# EAGLE design hdreader (EAGLE 6.5.0)
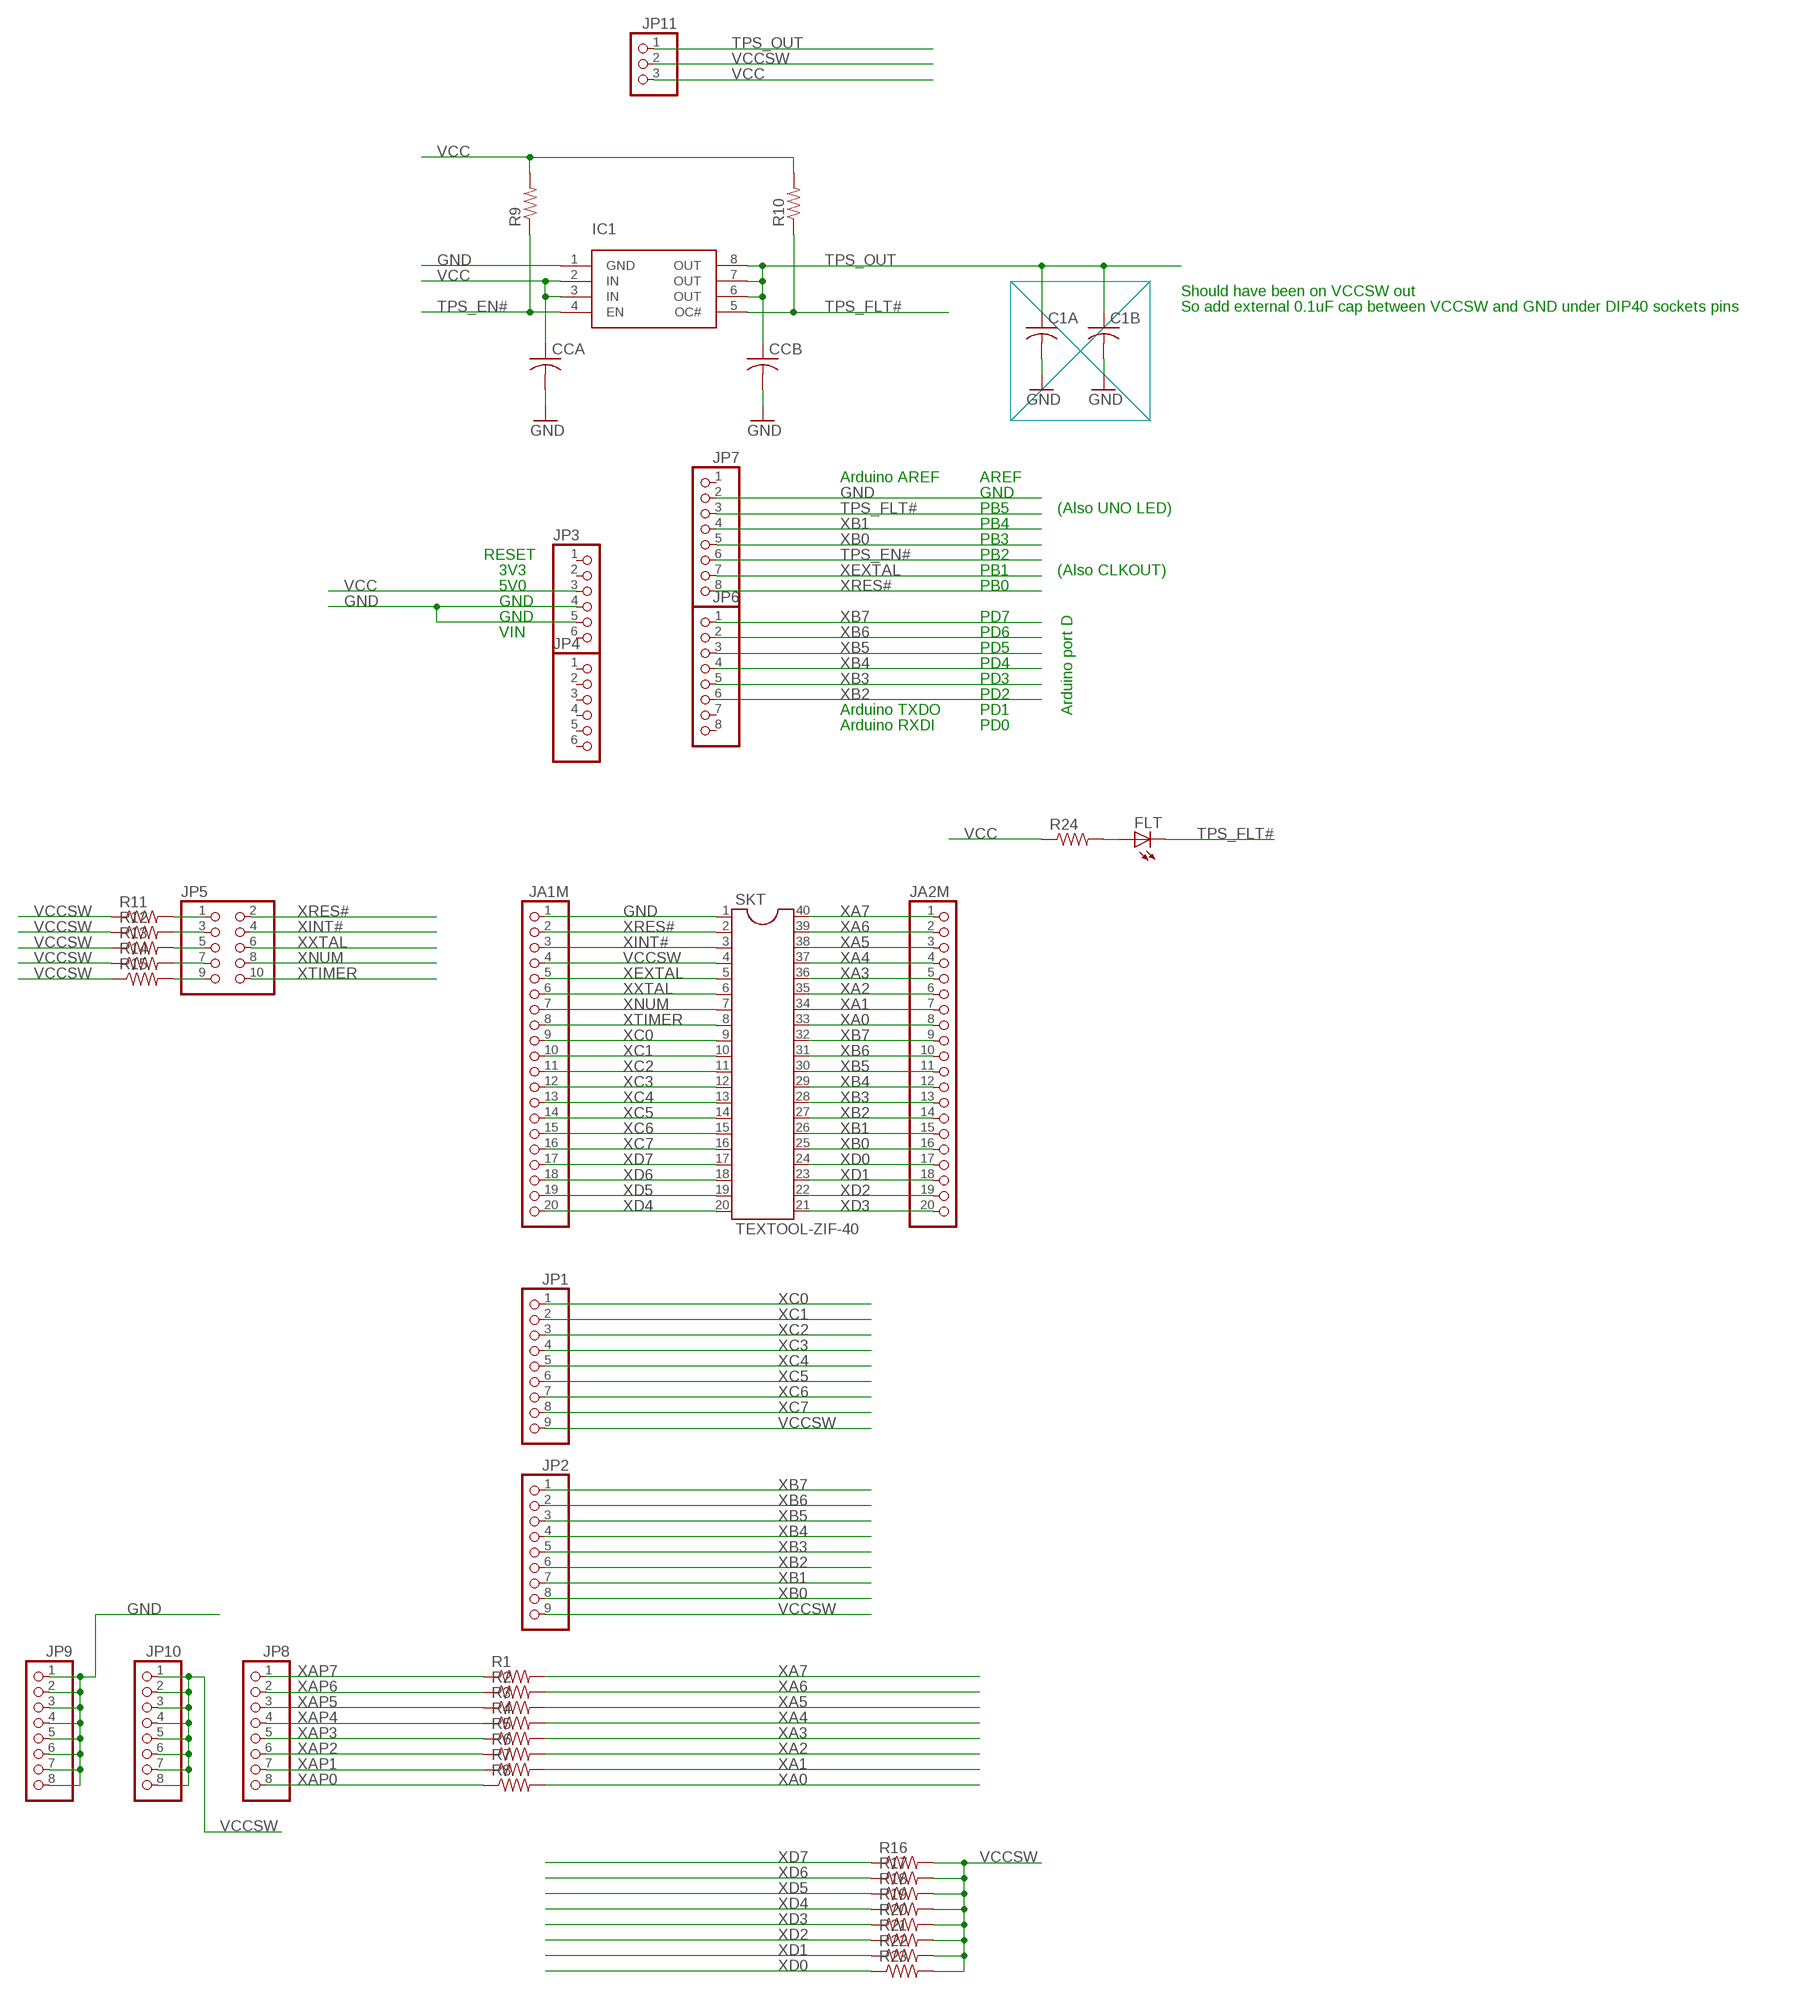
[diagram p0: schematic, sheet 1]

## Parts
C1A  C-USC0603  [C0603]
C1B  C-USC0603  [C0603]
CCA  C-USC0603  [C0603]
CCB  C-USC0603  [C0603]
FLT  LED3MM  [LED3MM]
IC1  TPS2051D  [SOIC8]
JA1M  PINHD-1X20  [1X20]
JA2M  PINHD-1X20  [1X20]
JP1  PINHD-1X9  [1X09]
JP2  PINHD-1X9  [1X09]
JP3  PINHD-1X6  [1X06]
JP4  PINHD-1X6  [1X06]
JP5  PINHD-2X5  [2X05]
JP6  PINHD-1X8  [1X08]
JP7  PINHD-1X8  [1X08]
JP8  PINHD-1X8  [1X08]
JP9  PINHD-1X8  [1X08]
JP10  PINHD-1X8  [1X08]
JP11  PINHD-1X3  [1X03]
R1  R-US_R0603  [R0603]
R2  R-US_R0603  [R0603]
R3  R-US_R0603  [R0603]
R4  R-US_R0603  [R0603]
R5  R-US_R0603  [R0603]
R6  R-US_R0603  [R0603]
R7  R-US_R0603  [R0603]
R8  R-US_R0603  [R0603]
R9  R-US_R0603  [R0603]
R10  R-US_R0603  [R0603]
R11  R-US_R0603  [R0603]
R12  R-US_R0603  [R0603]
R13  R-US_R0603  [R0603]
R14  R-US_R0603  [R0603]
R15  R-US_R0603  [R0603]
R16  R-US_R0603  [R0603]
R17  R-US_R0603  [R0603]
R18  R-US_R0603  [R0603]
R19  R-US_R0603  [R0603]
R20  R-US_R0603  [R0603]
R21  R-US_R0603  [R0603]
R22  R-US_R0603  [R0603]
R23  R-US_R0603  [R0603]
R24  R-US_R0603  [R0603]
SKT  TEXTOOL-ZIF-40  [TEXTOOL-DIP-40]

## Nets
GND: C1A.2 C1B.2 CCA.2 CCB.2 IC1.1(GND) JA1M.1 JP3.4 JP3.5 JP7.2 JP9.1 JP9.2 JP9.3 JP9.4 JP9.5 JP9.6 JP9.7 JP9.8 SKT.1
N$1: FLT.A R24.2
N$3: JP5.1 R11.2
N$4: JP5.3 R12.2
N$5: JP5.5 R13.2
N$14: JP5.7 R14.2
N$15: JP5.9 R15.2
TPS_EN#: IC1.4(EN) JP7.6 R9.1
TPS_FLT#: FLT.K(C) IC1.5(OC#) JP7.3 R10.1
TPS_OUT: C1A.1 C1B.1 CCB.1 IC1.6(OUT) IC1.7(OUT) IC1.8(OUT) JP11.1
VCC: CCA.1 IC1.2(IN) IC1.3(IN) JP3.3 JP11.3 R9.2 R10.2 R24.1
VCCSW: JA1M.4 JP1.9 JP2.9 JP10.1 JP10.2 JP10.3 JP10.4 JP10.5 JP10.6 JP10.7 JP10.8 JP11.2 R11.1 R12.1 R13.1 R14.1 R15.1 R16.2 R17.2 R18.2 R19.2 R20.2 R21.2 R22.2 R23.2 SKT.4
XA0: JA2M.8 R8.2 SKT.33
XA1: JA2M.7 R7.2 SKT.34
XA2: JA2M.6 R6.2 SKT.35
XA3: JA2M.5 R5.2 SKT.36
XA4: JA2M.4 R4.2 SKT.37
XA5: JA2M.3 R3.2 SKT.38
XA6: JA2M.2 R2.2 SKT.39
XA7: JA2M.1 R1.2 SKT.40
XAP0: JP8.8 R8.1
XAP1: JP8.7 R7.1
XAP2: JP8.6 R6.1
XAP3: JP8.5 R5.1
XAP4: JP8.4 R4.1
XAP5: JP8.3 R3.1
XAP6: JP8.2 R2.1
XAP7: JP8.1 R1.1
XB0: JA2M.16 JP2.8 JP7.5 SKT.25
XB1: JA2M.15 JP2.7 JP7.4 SKT.26
XB2: JA2M.14 JP2.6 JP6.6 SKT.27
XB3: JA2M.13 JP2.5 JP6.5 SKT.28
XB4: JA2M.12 JP2.4 JP6.4 SKT.29
XB5: JA2M.11 JP2.3 JP6.3 SKT.30
XB6: JA2M.10 JP2.2 JP6.2 SKT.31
XB7: JA2M.9 JP2.1 JP6.1 SKT.32
XC0: JA1M.9 JP1.1 SKT.9
XC1: JA1M.10 JP1.2 SKT.10
XC2: JA1M.11 JP1.3 SKT.11
XC3: JA1M.12 JP1.4 SKT.12
XC4: JA1M.13 JP1.5 SKT.13
XC5: JA1M.14 JP1.6 SKT.14
XC6: JA1M.15 JP1.7 SKT.15
XC7: JA1M.16 JP1.8 SKT.16
XD0: JA2M.17 R23.1 SKT.24
XD1: JA2M.18 R22.1 SKT.23
XD2: JA2M.19 R21.1 SKT.22
XD3: JA2M.20 R20.1 SKT.21
XD4: JA1M.20 R19.1 SKT.20
XD5: JA1M.19 R18.1 SKT.19
XD6: JA1M.18 R17.1 SKT.18
XD7: JA1M.17 R16.1 SKT.17
XEXTAL: JA1M.5 JP7.7 SKT.5
XINT#: JA1M.3 JP5.4 SKT.3
XNUM: JA1M.7 JP5.8 SKT.7
XRES#: JA1M.2 JP5.2 JP7.8 SKT.2
XTIMER: JA1M.8 JP5.10 SKT.8
XXTAL: JA1M.6 JP5.6 SKT.6
Unconnected: JP3.1 JP3.2 JP3.6 JP4.1 JP4.2 JP4.3 JP4.4 JP4.5 JP4.6 JP6.7 JP6.8 JP7.1

## Notes on the sheet
- Should have been on VCCSW out
- So add external 0.1uF cap between VCCSW and GND under DIP40 sockets pins
- Arduino AREF | AREF
- GND
- PB5 | (Also UNO LED)
- PB4
- PB3
- RESET | PB2
- 3V3 | PB1 | (Also CLKOUT)
- 5V0 | PB0
- GND
- GND | PD7
- VIN | PD6
- PD5
- PD4
- PD3
- PD2
- Arduino TXDO | PD1 | Arduino port D
- Arduino RXDI | PD0

## Library data of the parts
C1A C1B CCA CCB = rcl:C-US: CAPACITOR, American symbol
FLT = led:LED: LED OSRAM: - CHIPLED LG R971, LG N971, LY N971, LG Q971, LY Q971, LO R971, LY R971 LH N974, LH R974 LS Q976, LO Q976, LY Q976 LO Q996 - Hyper CHIPLED LW Q18S LB Q993, LB Q99A, LB R99A - SideLED LS A670, LO A670, LY A670, LG A670, LP A670 LB A673, LV A673, LT A673, LW A673 LH A674 LY A675 LS A676, LA A676, LO A676, LY A676, LW A676 LS A679, LY A679, LG A679 - Hyper Micro SIDELED® LS Y876, LA Y876, LO Y876, LY Y876 LT Y87S - SmartLED LW L88C, LW L88S LB L89C, LB L89S, LG L890 LS L89K, LO L89K, LY L89K LS L896, LA L896, LO L896, LY L896 - TOPLED LS T670, LO T670, LY T670, LG T670, LP T670 LSG T670, LSP T670, LSY T670, LOP T670, LYG T670 LG T671, LOG T671, LSG T671 LB T673, LV T673, LT T673, LW T673 LH T674 LS T676, LA T676, LO T676, LY T676, LB T676, LH T676, LSB T676, LW T676 LB T67C, LV T67C, LT T67C, LS T67K, LO T67K, LY T67K, LW E67C LS E67B, LA E67B, LO E67B, LY E67B, LB E67C, LV E67C, LT E67C LW T67C LS T679, LY T679, LG T679 LS T770, LO T770, LY T770, LG T770, LP T770 LB T773, LV T773, LT T773, LW T773 LH T774 LS E675, LA E675, LY E675, LS T675 LS T776, LA T776, LO T776, LY T776, LB T776 LHGB T686 LT T68C, LB T68C - Hyper Mini TOPLED® LB M676 - Mini TOPLED Santana® LG M470 LS M47K, LO M47K, LY M47K Source: http://www.osram.convergy.de LUXEON: - LUMILED® LXK2-PW12-R00, LXK2-PW12-S00, LXK2-PW14-U00, LXK2-PW14-V00 LXK2-PM12-R00, LXK2-PM12-S00, LXK2-PM14-U00 LXK2-PE12-Q00, LXK2-PE12-R00, LXK2-PE12-S00, LXK2-PE14-T00, LXK2-PE14-U00 LXK2-PB12-K00, LXK2-PB12-L00, LXK2-PB12-M00, LXK2-PB14-N00, LXK2-PB14-P00, LXK2-PB14-Q00 LXK2-PR12-L00, LXK2-PR12-M00, LXK2-PR14-Q00, LXK2-PR14-R00 LXK2-PD12-Q00, LXK2-PD12-R00, LXK2-PD12-S00 LXK2-PH12-R00, LXK2-PH12-S00 LXK2-PL12-P00, LXK2-PL12-Q00, LXK2-PL12-R00 Source: www.luxeon.com KINGBRIGHT: KA-3528ASYC Source: www.kingbright.com
IC1 = charles-lib:TPS2051D: TPS2051D
JA1M JA2M = pinhead:PINHD-1X20: PIN HEADER
JP1 JP2 = pinhead:PINHD-1X9: PIN HEADER
JP3 JP4 = pinhead:PINHD-1X6: PIN HEADER
JP5 = pinhead:PINHD-2X5: PIN HEADER
JP6-JP10 = pinhead:PINHD-1X8: PIN HEADER
JP11 = pinhead:PINHD-1X3: PIN HEADER
R1-R24 = rcl:R-US_: RESISTOR, American symbol
SKT = charles-lib:TEXTOOL-ZIF-40

## Board
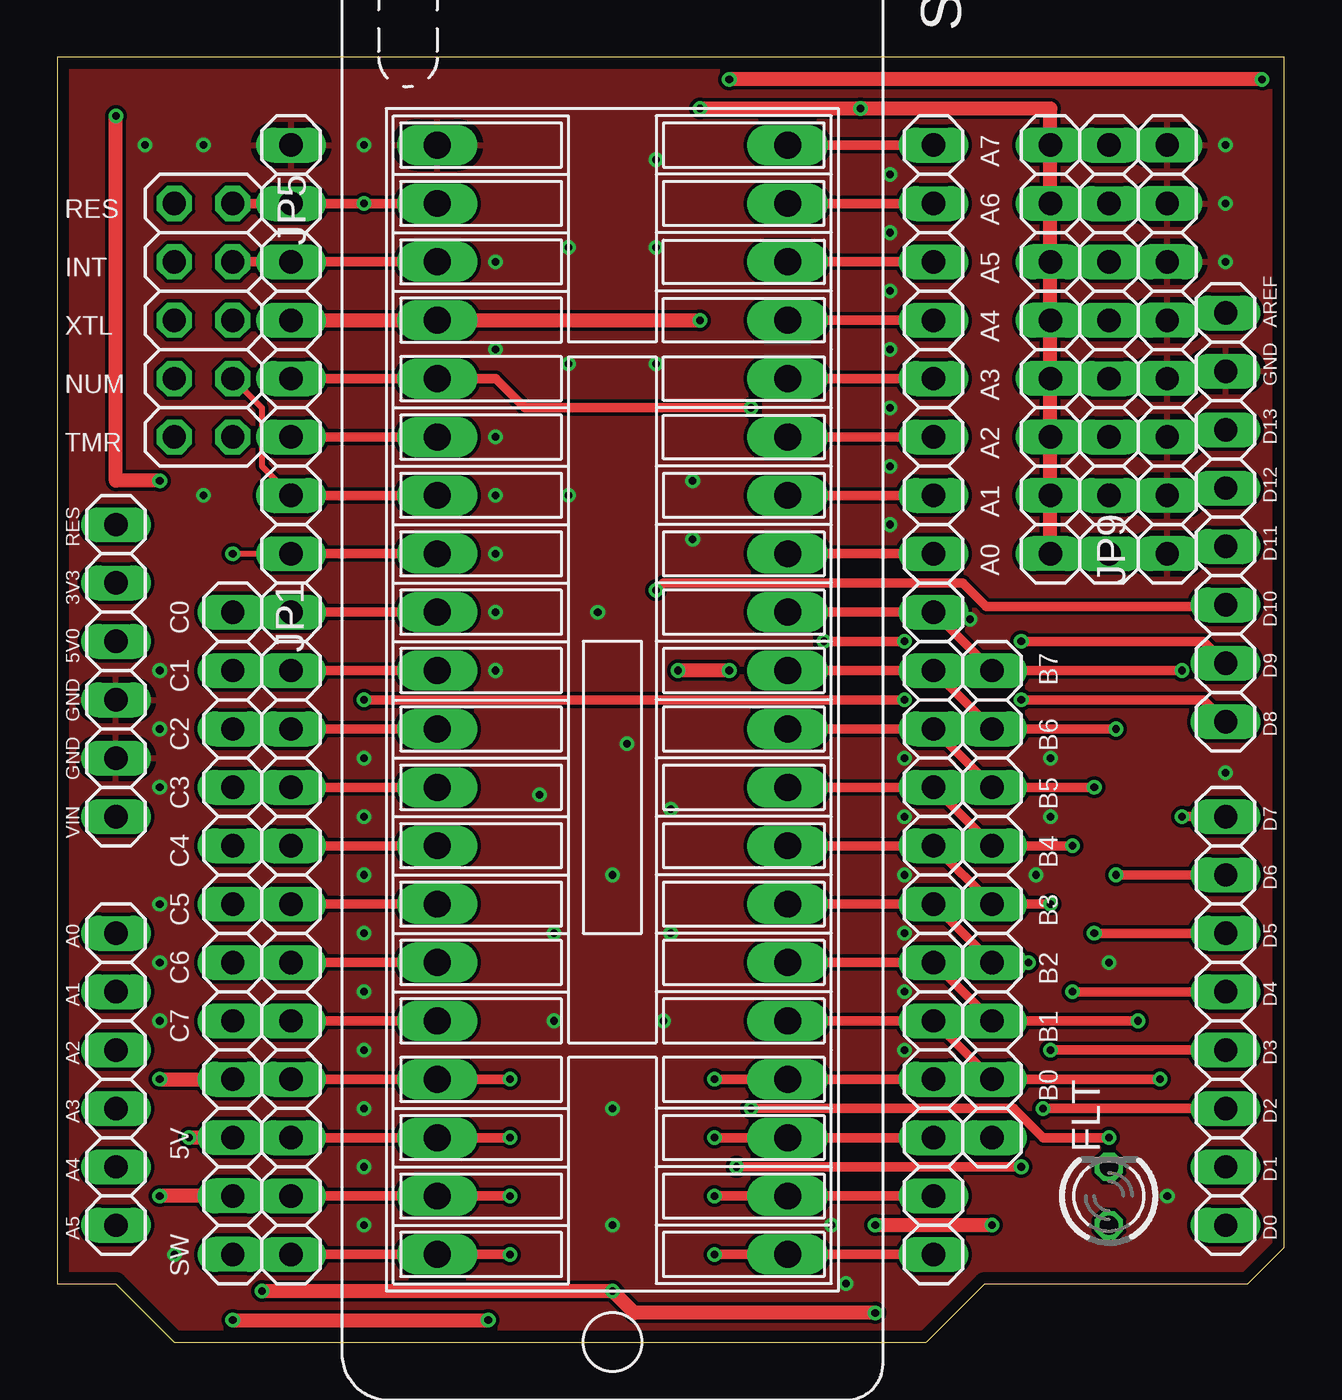
[diagram p1: board, top side]
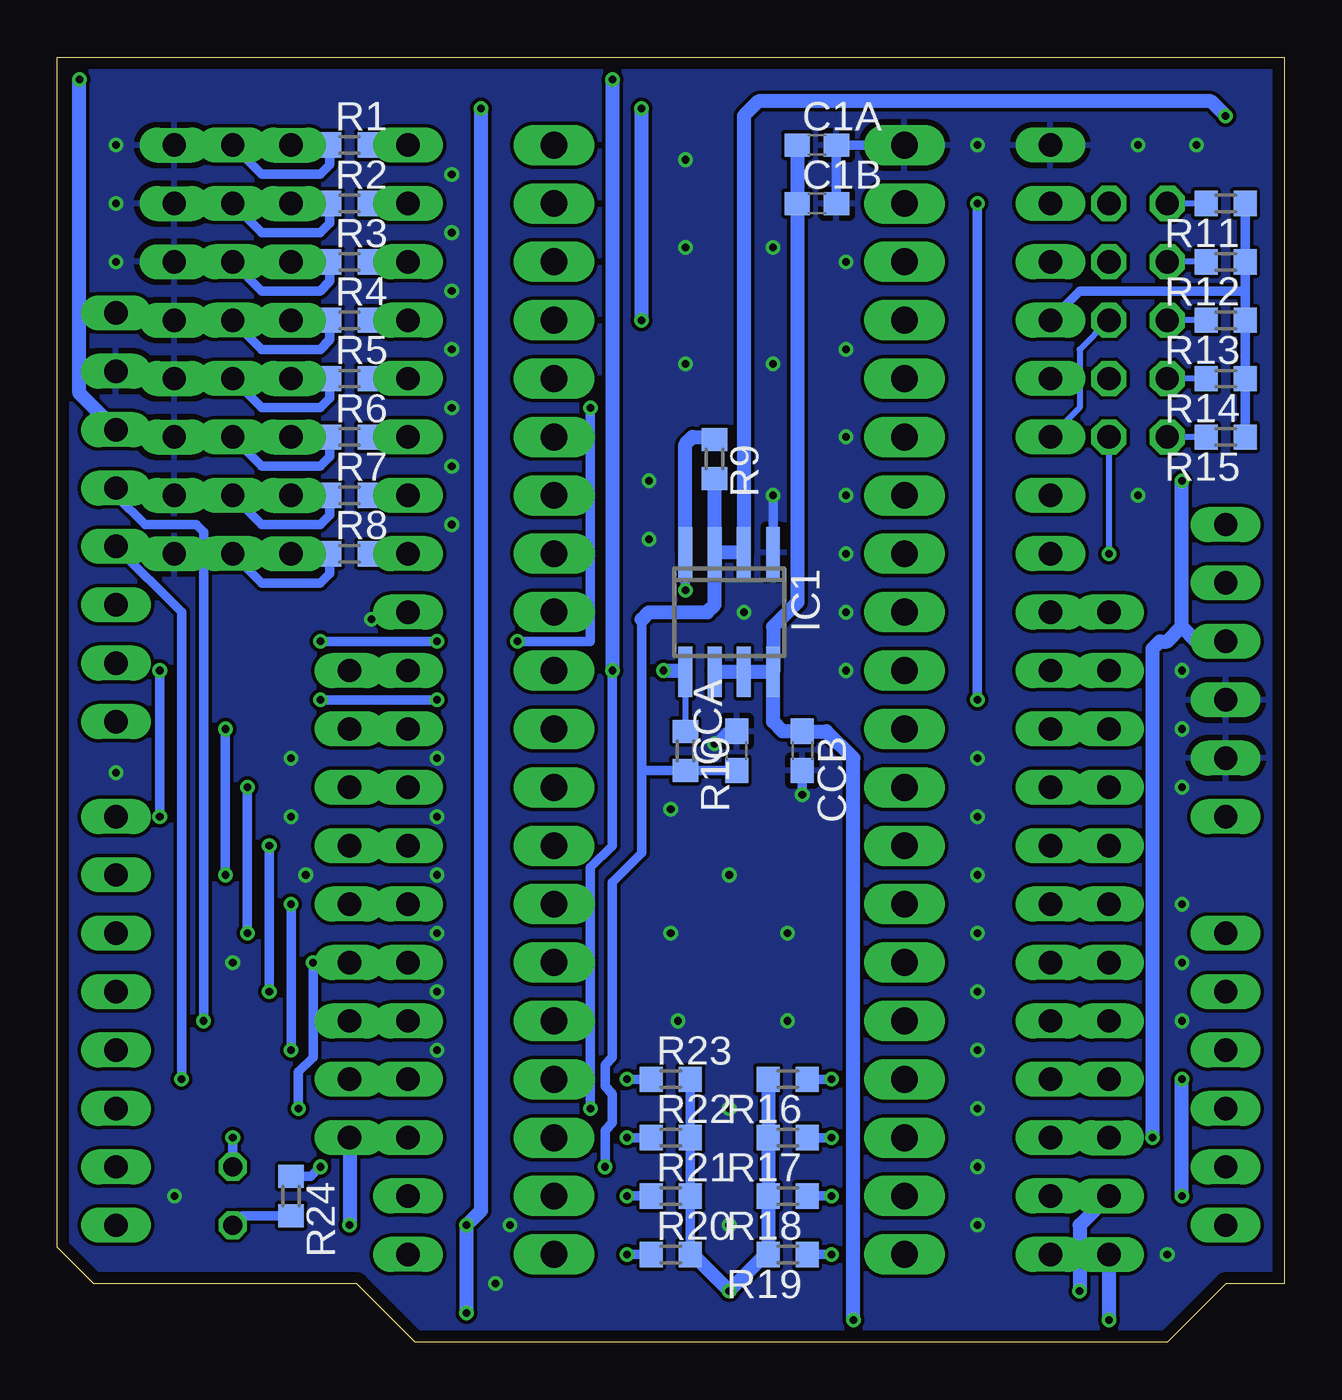
[diagram p2: board, bottom side, seen from below]

Size 53.34 x 55.88 mm. Coordinates in mm from the lower left corner, seen from the top.
Outline: 5.08,0 37.78,0 40.32,2.54 51.75,2.54 53.34,4.13 53.34,55.88 0,55.88 0,2.54 2.54,2.54 5.08,0
Copper layers (1*16): Top 0.035mm / dielectric 1.6mm / Bottom 0.035mm
Design rules "Elecrow_2-layer_PCB_eagle_rule *": minimum track width 6mil, minimum drill 12mil, track to track 6mil, track to pad 6mil, pad to pad 6mil, via to via 8mil, smd to smd 0mil, copper to edge 20mil, drill to drill 10mil, minimum pad ring 6mil, minimum via ring 6mil, stop-mask expansion 0mil, vias tented up to drill 100mil, thermal gap 10mil

### Footprints (pad centres in the part's own frame; a part is rotated, then mirrored left to right if it is on the bottom)
C0603 = smd 1.1 x 1: 1 -0.85,0; 2 0.85,0
LED3MM = drill 0.813 octagon: A -1.27,0; K 1.27,0
SOIC8 = smd 0.6 x 2.2: 1 -1.905,-2.6; 2 -0.635,-2.6; 3 0.635,-2.6; 4 1.905,-2.6; 5 1.905,2.6; 6 0.635,2.6; 7 -0.635,2.6; 8 -1.905,2.6
1X20 = drill 1.016 long: 1 -24.13,0; 2 -21.59,0; 3 -19.05,0; 4 -16.51,0; 5 -13.97,0; 6 -11.43,0; 7 -8.89,0; 8 -6.35,0; 9 -3.81,0; 10 -1.27,0; 11 1.27,0; 12 3.81,0; 13 6.35,0; 14 8.89,0; 15 11.43,0; 16 13.97,0; 17 16.51,0; 18 19.05,0; 19 21.59,0; 20 24.13,0
1X09 = drill 1.016 long: 1 -10.16,0; 2 -7.62,0; 3 -5.08,0; 4 -2.54,0; 5 0,0; 6 2.54,0; 7 5.08,0; 8 7.62,0; 9 10.16,0
1X06 = drill 1.016 long: 1 -6.35,0; 2 -3.81,0; 3 -1.27,0; 4 1.27,0; 5 3.81,0; 6 6.35,0
2X05 = drill 1.016 octagon: 1 -5.08,-1.27; 2 -5.08,1.27; 3 -2.54,-1.27; 4 -2.54,1.27; 5 0,-1.27; 6 0,1.27; 7 2.54,-1.27; 8 2.54,1.27; 9 5.08,-1.27; 10 5.08,1.27
1X08 = drill 1.016 long: 1 -8.89,0; 2 -6.35,0; 3 -3.81,0; 4 -1.27,0; 5 1.27,0; 6 3.81,0; 7 6.35,0; 8 8.89,0
1X03 = drill 1.016 long: 1 -2.54,0; 2 0,0; 3 2.54,0
R0603 = smd 1 x 1.1: 1 -0.85,0; 2 0.85,0
TEXTOOL-DIP-40 = drill 1.168 long: 1 -20.32,-7.62; 2 -17.78,-7.62; 3 -15.24,-7.62; 4 -12.7,-7.62; 5 -10.16,-7.62; 6 -7.62,-7.62; 7 -5.08,-7.62; 8 -2.54,-7.62; 9 0,-7.62; 10 2.54,-7.62; 11 5.08,-7.62; 12 7.62,-7.62; 13 10.16,-7.62; 14 12.7,-7.62; 15 15.24,-7.62; 16 17.78,-7.62; 17 20.32,-7.62; 18 22.86,-7.62; 19 25.4,-7.62; 20 27.94,-7.62; 21 27.94,7.62; 22 25.4,7.62; 23 22.86,7.62; 24 20.32,7.62; 25 17.78,7.62; 26 15.24,7.62; 27 12.7,7.62; 28 10.16,7.62; 29 7.62,7.62; 30 5.08,7.62; 31 2.54,7.62; 32 0,7.62; 33 -2.54,7.62; 34 -5.08,7.62; 35 -7.62,7.62; 36 -10.16,7.62; 37 -12.7,7.62; 38 -15.24,7.62; 39 -17.78,7.62; 40 -20.32,7.62

### Placement (x,y rotation side)
C1A  20.32,52.07 0 bottom
C1B  20.32,49.53 0 bottom
CCA  23.81,25.72 90 bottom
CCB  20.95,25.72 270 bottom
FLT  45.72,6.35 90 top
IC1  24.13,31.75 180 bottom
JA1M  10.16,27.94 270 top
JA2M  38.1,27.94 270 top
JP1  7.62,21.59 270 top
JP2  40.64,19.05 270 top
JP3  2.54,29.21 270 top
JP4  2.54,11.43 270 top
JP5  6.35,44.45 270 top
JP6  50.8,13.97 270 top
JP7  50.8,35.88 270 top
JP8  45.72,43.18 270 top
JP9  48.26,43.18 90 top
JP10  43.18,43.18 90 top
JP11  7.62,6.35 90 top
R1  40.64,52.07 0 bottom
R2  40.64,49.53 0 bottom
R3  40.64,46.99 0 bottom
R4  40.64,44.45 0 bottom
R5  40.64,41.91 0 bottom
R6  40.64,39.37 0 bottom
R7  40.64,36.83 0 bottom
R8  40.64,34.29 0 bottom
R9  24.77,38.42 270 bottom
R10  26.04,25.72 270 bottom
R11  2.54,49.53 180 bottom
R12  2.54,46.99 180 bottom
R13  2.54,44.45 180 bottom
R14  2.54,41.91 180 bottom
R15  2.54,39.37 180 bottom
R16  21.59,11.43 180 bottom
R17  21.59,8.89 180 bottom
R18  21.59,6.35 180 bottom
R19  21.59,3.81 180 bottom
R20  26.67,3.81 0 bottom
R21  26.67,6.35 0 bottom
R22  26.67,8.89 0 bottom
R23  26.67,11.43 0 bottom
R24  43.18,6.35 270 bottom
SKT  24.13,31.75 270 top

### Tracks (layer width: path | path; a pad name or v marks a point on that pad's centre or on a via)
GND  (via drill 0.33)
  Bottom 0.406: IC1.1 v22.23,36.83 | SKT.1 C1A.2 C1B.2 | CCB.2 v20.95,23.81 | CCA.2 24.23,26.57 v24.77,26.04
  other vias: 19.05,36.83 19.05,39.37 19.05,34.29 19.05,31.75 19.05,29.21 13.34,25.4 13.34,22.86 13.34,20.32 13.34,17.78 13.34,15.24 13.34,12.7 13.34,10.16 13.34,7.62 13.34,5.08 5.08,3.81 4.45,13.97 4.45,16.51 4.45,19.05 4.45,24.13 4.45,26.67 4.45,29.21 6.35,36.83 3.81,52.07 6.35,52.07 13.34,52.07 19.05,46.99 26.04,51.44 26.04,47.62 26.04,42.55 27.62,37.46 27.62,34.92 23.5,31.75 26.67,23.18 26.67,17.78 21.59,17.78 21.59,13.97 26.35,13.97 24.13,5.08 24.13,10.16 33.66,5.08 34.29,2.54 48.26,6.35 45.72,16.51 43.18,25.4 43.18,22.86 42.55,20.32 50.8,24.77 50.8,46.99 50.8,52.07 50.8,49.53 36.2,50.8 36.2,48.26 36.2,45.72 36.2,43.18 36.2,40.64 36.2,38.1 36.2,35.56 39.69,31.43 22.23,47.62 22.23,42.55 19.05,43.18 24.13,20.32 36.83,12.7 36.83,15.24 36.83,17.78 36.83,20.32 36.83,22.86 36.83,25.4
  pour Top: 0,55.88 53.34,55.88 53.34,4.13 51.75,2.54 40.32,2.54 37.78,0 5.08,0 2.54,2.54 0,2.54
  pour Bottom: 0,55.88 0,2.54 2.54,2.54 5.08,0 37.78,0 40.32,2.54 51.75,2.54 53.34,4.13 53.34,55.88
N$1
  Bottom 0.406: R24.2 45.3,5.5 FLT.A
N$3
  Bottom 0.254: R11.2 JP5.1
N$4
  Bottom 0.254: R12.2 JP5.3
N$5
  Bottom 0.254: R13.2 JP5.5
N$14
  Bottom 0.254: R14.2 JP5.7
N$15
  Bottom 0.254: R15.2 JP5.9
TPS_EN#  (via drill 0.33)
  Top 0.406: v26.04,32.7 26.35,33.02 39.37,33.02 40.39,32 50.74,32 JP7.6
  Bottom 0.254: 24.87,39.37 R9.1
  Bottom 0.406: v26.04,32.7 IC1.4
  Bottom 0.61: IC1.4 26.04,39.05 25.72,39.37 24.87,39.37
TPS_FLT#  (via drill 0.33)
  Top 0.406: v45.72,8.89 42.86,8.89 41.59,10.16 v30.16,10.16
  Top 0.61: v52.39,54.93 v29.21,54.93 | v29.21,29.21 v26.99,29.21
  Bottom 0.254: IC1.5 R10.1
  Bottom 0.406: 26.09,29.21 IC1.5 | FLT.K v45.72,8.89 | v30.16,10.16 30.16,20.64 29.21,21.59 v29.21,29.21
  Bottom 0.61: JP7.3 52.39,41.27 v52.39,54.93 | v29.21,54.93 v29.21,29.21 | v26.99,29.21 26.09,29.21
TPS_OUT  (via drill 0.33)
  Top 0.61: v7.62,0.95 v18.73,0.95
  Bottom 0.61: IC1.8 IC1.7 IC1.6 | C1A.1 C1B.1 21.17,32.17 22.23,31.11 IC1.8 | IC1.8 22.23,26.99 21.8,26.57 CCB.1 19.9,26.57 18.73,25.4 v18.73,0.95 | JP11.1 v7.62,0.95
VCC  (via drill 0.33)
  Top 0.406: v41.91,7.62 v29.53,7.62
  Top 0.61: v4.45,37.46 2.54,37.46 v2.54,53.34 | JP11.3 v5.71,8.89
  Bottom 0.406: CCA.1 R10.2 27.84,24.87 27.94,24.77 | R24.1 42.33,7.2 v41.91,7.62 | v29.53,7.62 29.53,9.21 29.21,9.53 29.21,10.8 29.53,11.11 29.53,12.07 29.21,12.38 29.21,20 27.94,21.27 27.94,24.77 | 27.94,31.43 27.94,24.77
  Bottom 0.61: JP3.3 3.81,30.48 4.45,31.11 | 4.45,31.11 v4.45,37.46 | v2.54,53.34 3.17,53.98 22.86,53.98 23.5,53.34 IC1.2 IC1.3 | IC1.3 R9.2 | 27.94,31.43 27.62,31.75 25.08,31.75 24.77,32.07 IC1.3 | v5.71,8.89 5.71,30.16 5.4,30.48 5.08,30.48 4.45,31.11
VCCSW  (via drill 0.33)
  Top 0.61: JA1M.4 SKT.4 v27.94,44.45 | v27.94,53.66 v34.92,53.66 43.18,53.66 JP10.8 JP10.7 JP10.6 JP10.5 JP10.4 JP10.3 JP10.2 JP10.1 | v8.89,2.22 v24.13,2.22 25.08,1.27 v35.56,1.27 | JP11.2 v4.45,6.35 | v4.45,11.43 JP1.9 | v40.64,5.08 v35.56,5.08
  Bottom 0.406: R20.2 R21.2 R22.2 R23.2 | R11.1 R12.1 1.69,45.72 | 1.69,45.72 R13.1 R14.1 R15.1 | JA1M.4 8.89,45.72 1.69,45.72
  Bottom 0.61: v27.94,44.45 v27.94,53.66 | JP11.2 8.89,5.08 v8.89,2.22 | v4.45,6.35 v4.45,11.43 | R16.2 R17.2 R18.2 R19.2 22.54,3.81 v24.13,2.22 25.72,3.81 R20.2 | JP2.9 v40.64,5.08 | v35.56,1.27 v35.56,5.08 34.92,5.71 v34.92,53.66
XA0
  Top 0.406: SKT.33 JA2M.8
  Bottom 0.406: R8.2 JA2M.8
XA1
  Top 0.406: SKT.34 JA2M.7
  Bottom 0.406: R7.2 JA2M.7
XA2
  Top 0.406: SKT.35 JA2M.6
  Bottom 0.406: R6.2 JA2M.6
XA3
  Top 0.406: SKT.36 JA2M.5
  Bottom 0.406: R5.2 JA2M.5
XA4
  Top 0.406: SKT.37 JA2M.4
  Bottom 0.406: R4.2 JA2M.4
XA5
  Top 0.406: SKT.38 JA2M.3
  Bottom 0.406: R3.2 JA2M.3
XA6
  Top 0.406: SKT.39 JA2M.2
  Bottom 0.406: R2.2 JA2M.2
XA7
  Top 0.406: SKT.40 JA2M.1
  Bottom 0.406: R1.2 JA2M.1
XAP0
  Bottom 0.406: R8.1 41.49,33.44 41.91,33.02 44.45,33.02 JP8.8
XAP1
  Bottom 0.406: R7.1 41.49,35.98 41.91,35.56 44.45,35.56 JP8.7
XAP2
  Bottom 0.406: R6.1 41.49,38.52 41.91,38.1 44.45,38.1 JP8.6
XAP3
  Bottom 0.406: R5.1 41.49,41.06 41.91,40.64 44.45,40.64 JP8.5
XAP4
  Bottom 0.406: R4.1 41.49,43.6 41.91,43.18 44.45,43.18 JP8.4
XAP5
  Bottom 0.406: R3.1 41.49,46.14 41.91,45.72 44.45,45.72 JP8.3
XAP6
  Bottom 0.406: R2.1 41.49,48.68 41.91,48.26 44.45,48.26 JP8.2
XAP7
  Bottom 0.406: R1.1 41.49,51.22 41.91,50.8 44.45,50.8 JP8.1
XB0  (via drill 0.33)
  Top 0.406: SKT.25 JA2M.16 JP2.8 v47.94,11.43
  Bottom 0.406: v47.94,11.43 47.94,31.75 JP7.5
XB1  (via drill 0.33)
  Top 0.406: SKT.26 JA2M.15 JP2.7 v46.99,13.97
  Bottom 0.406: JP7.4 50.8,36.83 49.53,35.56 47.31,35.56 46.99,35.24 v46.99,13.97
XB2  (via drill 0.33)
  Top 0.406: SKT.27 JA2M.14 JP2.6 v42.23,16.51 | v42.86,10.16 JP6.6
  Bottom 0.406: v42.23,16.51 42.23,12.38 42.86,11.75 v42.86,10.16
XB3  (via drill 0.33)
  Top 0.406: SKT.28 JA2M.13 JP2.5 v43.18,19.05 | v43.18,12.7 JP6.5
  Bottom 0.406: v43.18,19.05 v43.18,12.7
XB4  (via drill 0.33)
  Top 0.406: SKT.29 JA2M.12 JP2.4 v44.13,21.59 | v44.13,15.24 JP6.4
  Bottom 0.406: v44.13,21.59 v44.13,15.24
XB5  (via drill 0.33)
  Top 0.406: SKT.30 JA2M.11 JP2.3 v45.09,24.13 | v45.09,17.78 JP6.3
  Bottom 0.406: v45.09,24.13 v45.09,17.78
XB6  (via drill 0.33)
  Top 0.406: SKT.31 JA2M.10 JP2.2 v46.04,26.67 | v46.04,20.32 JP6.2
  Bottom 0.406: v46.04,26.67 v46.04,20.32
XB7  (via drill 0.33)
  Top 0.406: SKT.32 JA2M.9 JP2.1 v48.9,29.21 | v48.9,22.86 JP6.1
  Bottom 0.406: v48.9,29.21 v48.9,22.86
XC0
  Top 0.406: SKT.9 JA1M.9 JP1.1
XC1
  Top 0.406: SKT.10 JA1M.10 JP1.2
XC2
  Top 0.406: SKT.11 JA1M.11 JP1.3
XC3
  Top 0.406: SKT.12 JA1M.12 JP1.4
XC4
  Top 0.406: SKT.13 JA1M.13 JP1.5
XC5
  Top 0.406: SKT.14 JA1M.14 JP1.6
XC6
  Top 0.406: SKT.15 JA1M.15 JP1.7
XC7
  Top 0.406: SKT.16 JA1M.16 JP1.8
XD0  (via drill 0.33)
  Top 0.406: JA2M.17 SKT.24 v28.57,11.43
  Bottom 0.406: R23.1 v28.57,11.43
XD1  (via drill 0.33)
  Top 0.406: JA2M.18 SKT.23 v28.57,8.89
  Bottom 0.406: R22.1 v28.57,8.89
XD2  (via drill 0.33)
  Top 0.406: JA2M.19 SKT.22 v28.57,6.35
  Bottom 0.406: v28.57,6.35 R21.1
XD3  (via drill 0.33)
  Top 0.406: JA2M.20 SKT.21 v28.57,3.81
  Bottom 0.406: R20.1 v28.57,3.81
XD4  (via drill 0.33)
  Top 0.406: JA1M.20 SKT.20 v19.68,3.81
  Bottom 0.406: v19.68,3.81 R19.1
XD5  (via drill 0.33)
  Top 0.406: JA1M.19 SKT.19 v19.68,6.35
  Bottom 0.406: v19.68,6.35 R18.1
XD6  (via drill 0.33)
  Top 0.406: JA1M.18 SKT.18 v19.68,8.89
  Bottom 0.406: v19.68,8.89 R17.1
XD7  (via drill 0.33)
  Top 0.406: JA1M.17 SKT.17 v19.68,11.43
  Bottom 0.406: v19.68,11.43 R16.1
XEXTAL  (via drill 0.33)
  Top 0.406: JA1M.5 SKT.5 19.05,41.91 20.32,40.64 v30.16,40.64 | v41.91,30.48 49.85,30.48 JP7.7 | v36.83,30.48 v33.34,30.48
  Bottom 0.406: v30.16,40.64 30.16,30.48 v33.34,30.48 | v41.91,30.48 v36.83,30.48
XINT#
  Top 0.406: SKT.3 JA1M.3 JP5.4
XNUM
  Top 0.254: JP5.8 8.89,40.64 8.89,38.1 JA1M.7
  Top 0.406: SKT.7 JA1M.7
XRES#  (via drill 0.33)
  Top 0.406: SKT.2 v13.34,49.53 JA1M.2 JP5.2 | v36.83,27.94 v13.34,27.94 | v41.91,27.94 49.85,27.94 JP7.8
  Bottom 0.406: v13.34,27.94 v13.34,49.53 | v41.91,27.94 v36.83,27.94
XTIMER  (via drill 0.33)
  Top 0.254: v7.62,34.29 JA1M.8
  Top 0.406: SKT.8 JA1M.8
  Bottom 0.254: JP5.10 v7.62,34.29
XXTAL
  Top 0.406: SKT.6 JA1M.6
  Bottom 0.254: JP5.6 8.89,43.18 8.89,40.64 JA1M.6

### Text on the board
tNames: A7 | RES | A6 | INT | A5 | AREF | XTL | A4 | NUM | GND | A3 | D13 | TMR | A2 | D12 | A1 | RES | A0 | D11 | 3V3 | D10 | C0 | 5V0 | C1 | B7 | D9 | GND | D8 | C2 | B6 | GND | C3 | B5 | D7 | VIN | C4 | B4 | D6 | C5 | B3 | A0 | D5 | C6 | B2 | A1 | D4 | A2 | C7 | B1 | D3 | B0 | A3 | D2 | 5V | A4 | D1 | A5 | D0 | SW
tPINALBEL: 0.1uF cap across pins 1,4